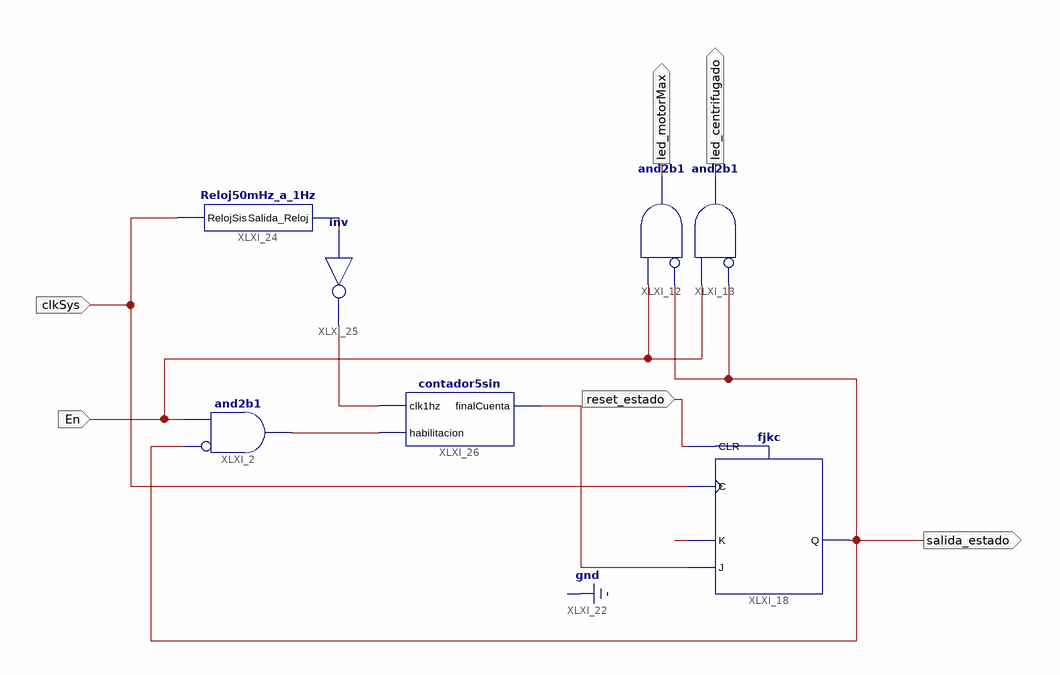
[diagram p0: schematic sheet 1]
// Xilinx ISE schematic centrifugado.sch (spartan3e) as structural Verilog: 7 symbols, 6 ports
module centrifugado (
  input  En,
  input  reset_estado,
  input  clkSys,
  output led_motorMax,
  output led_centrifugado,
  output salida_estado
);

  wire salidareloj1hz, XLXN_3, XLXN_47, XLXN_49;

  and XLXI_2 (XLXN_3, ~salida_estado, En);  // and2b1
  and XLXI_12 (led_motorMax, ~salida_estado, En);  // and2b1
  and XLXI_13 (led_centrifugado, ~salida_estado, En);  // and2b1
  fjkc XLXI_18 (.C(clkSys), .CLR(reset_estado), .J(XLXN_47), .K(1'b0), .Q(salida_estado));
  Reloj50mHz_a_1Hz XLXI_24 (.RelojSis(clkSys), .Salida_Reloj(XLXN_49));
  not XLXI_25 (salidareloj1hz, XLXN_49);
  contador5sin XLXI_26 (.clk1hz(salidareloj1hz), .habilitacion(XLXN_3), .finalCuenta(XLXN_47));
endmodule
